# Altium schematic sheet LCD.SchDoc
size 330 x 203 mm
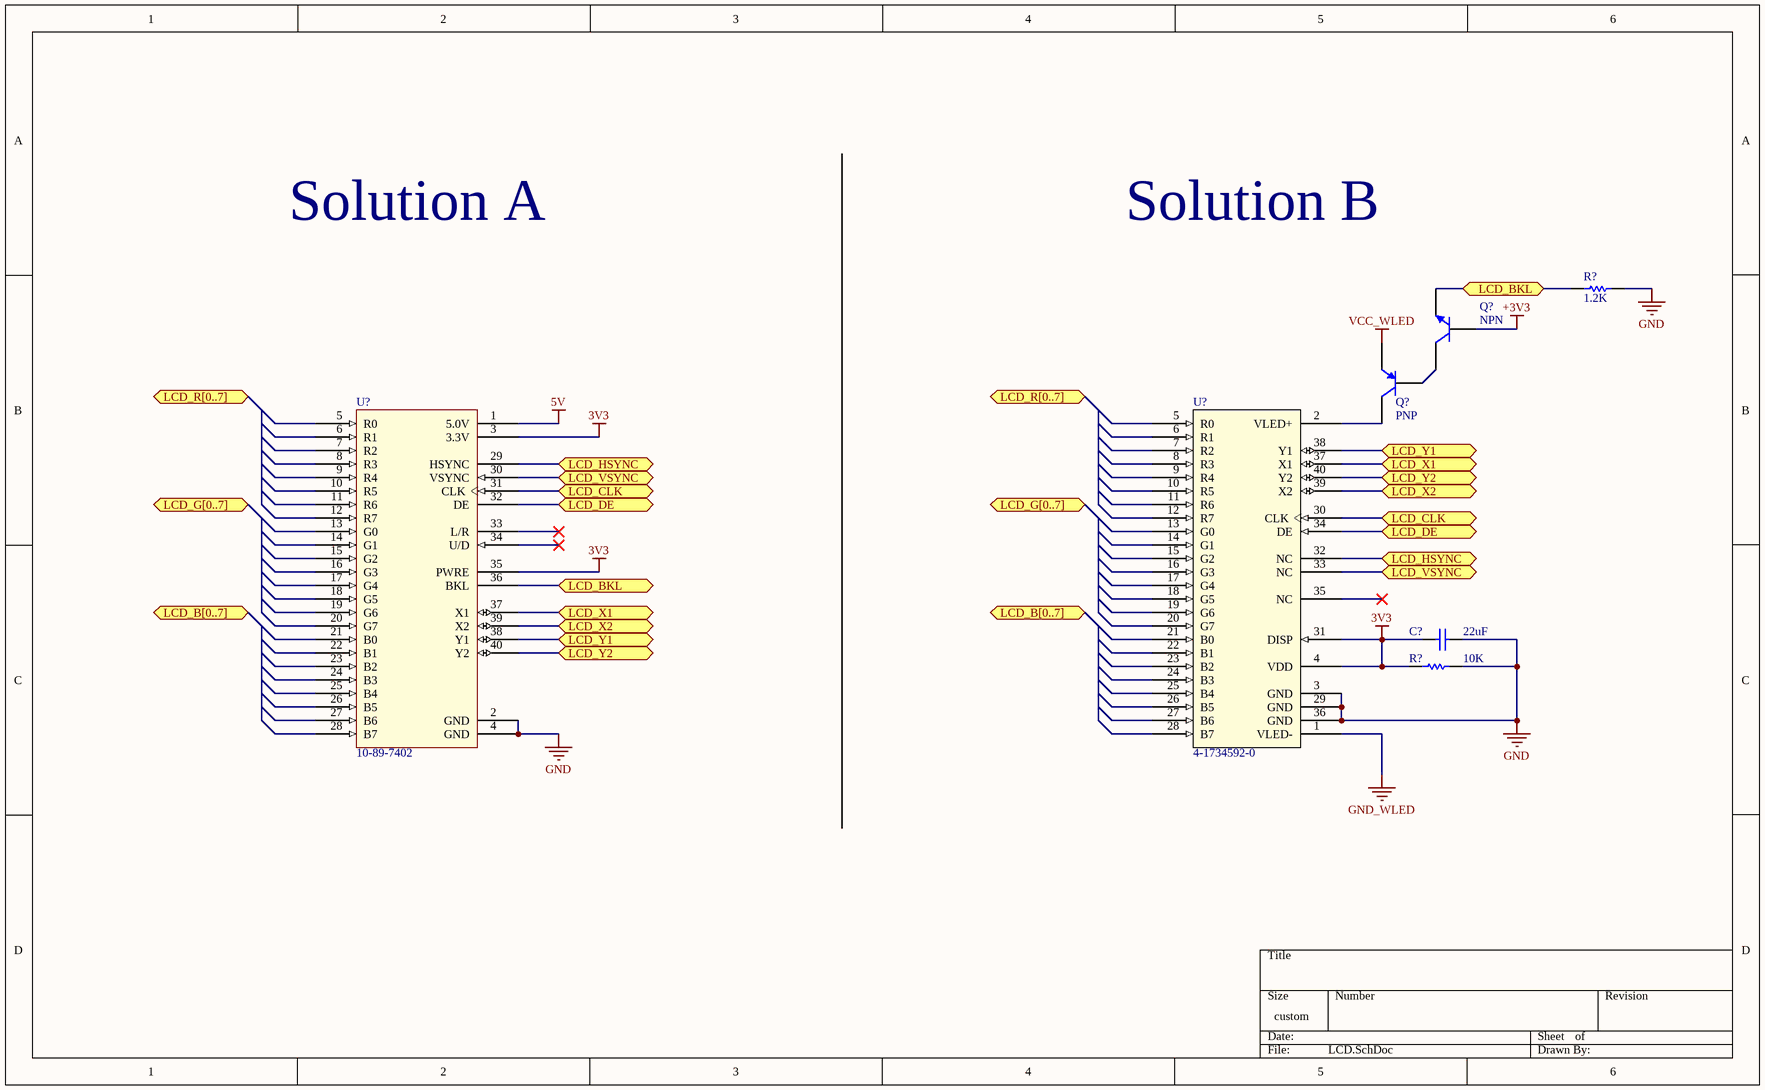
[diagram p0: LCD.SchDoc]

## Parts
(Parts that share a designator on the sheet are numbered #1, #2 ... from top to bottom, then left to right.)
C?  value 22uF  [RAD-0.3]  (hidden comment: Cap)
Q?#1  NPN  [TO-226-AA]
Q?#2  PNP  [SOT-23B_N]
R?#1  value 1.2K  [AXIAL-0.3]  (hidden comment: Res1)
R?#2  value 10K  [AXIAL-0.3]  (hidden comment: Res1)
U?#1  10-89-7402
U?#2  4-1734592-0

## Ports
LCD_B[0..7], LCD_BKL, LCD_CLK, LCD_DE, LCD_G[0..7], LCD_HSYNC, LCD_R[0..7], LCD_VSYNC, LCD_X1, LCD_X2, LCD_Y1, LCD_Y2

## Nets
3V3: C?.2 R?#2.2 U?#1.3(3.3V) U?#1.35(PWRE) U?#2.4(VDD) U?#2.31(DISP)
5V: U?#1.1(5.0V)
+3V3: Q?#1.2(B)
GND: C?.1 R?#1.1 R?#2.1 U?#1.2(GND) U?#1.4(GND) U?#2.3(GND) U?#2.29(GND) U?#2.36(GND)
GND_WLED: U?#2.1(VLED-)
VCC_WLED: Q?#2.3(E)
LCD_BKL: Q?#1.3(E) R?#1.2 U?#1.36(BKL) ; port LCD_BKL
LCD_CLK: U?#1.31(CLK) U?#2.30(CLK) ; port LCD_CLK
LCD_DE: U?#1.32(DE) U?#2.34(DE) ; port LCD_DE
LCD_HSYNC: U?#1.29(HSYNC) U?#2.32(NC) ; port LCD_HSYNC
LCD_VSYNC: U?#1.30(VSYNC) U?#2.33(NC) ; port LCD_VSYNC
LCD_X1: U?#1.37(X1) U?#2.37(X1) ; port LCD_X1
LCD_X2: U?#1.39(X2) U?#2.39(X2) ; port LCD_X2
LCD_Y1: U?#1.38(Y1) U?#2.38(Y1) ; port LCD_Y1
LCD_Y2: U?#1.40(Y2) U?#2.40(Y2) ; port LCD_Y2
NetQ?#1_1: Q?#1.1(C) Q?#2.2(B)
NetQ?#2_1: Q?#2.1(C) U?#2.2(VLED+)

Not connected (* = marked no-connect by the designer): U?#1 5(R0) 6(R1) 7(R2) 8(R3) 9(R4) 10(R5) 11(R6) 12(R7) 13(G0) 14(G1) 15(G2) 16(G3) 17(G4) 18(G5) 19(G6) 20(G7) 21(B0) 22(B1) 23(B2) 24(B3) 25(B4) 26(B5) 27(B6) 28(B7) 33(L/R)* 34(U/D)*; U?#2 5(R0) 6(R1) 7(R2) 8(R3) 9(R4) 10(R5) 11(R6) 12(R7) 13(G0) 14(G1) 15(G2) 16(G3) 17(G4) 18(G5) 19(G6) 20(G7) 21(B0) 22(B1) 23(B2) 24(B3) 25(B4) 26(B5) 27(B6) 28(B7) 35(NC)*

## Notes on the sheet
- Solution A
- Solution B

## Library data of the parts
C? = Cap: Capacitor
Q?#1 = NPN: NPN Bipolar Transistor; Fabricant: Rohm; Fournisseur: Farnell; RefFournisseur: 1680242; RefFabricant: DTC114YKAT146
Q?#2 = PNP: PNP Bipolar Transistor; RefFabricant: SMMUN2114LT1G; Fabricant: ON SEMICONDUCTOR; RefFournisseur: 2724481; Fournisseur: Farnell
R?#1 R?#2 = Res1: Resistor
U?#1 = GFT043HA480272Y: Connecteur LCD & Touch screen (limande); Fabricant: MOLEX; Fournisseur: Farnell; RefFournisseur: 2396214; RefFabricant: 10-89-7402
U?#2 = 4-1734592-0: Connecteur LCD & Touch screen; Fabricant: TE Connectivity; Fournisseur: Farnell; RefFournisseur: 1816399; RefFabricant: 4-1734592-0